# Altium schematic sheet Sheet1.SchDoc
size A4; SheetNumber: 1; SheetTotal: 1
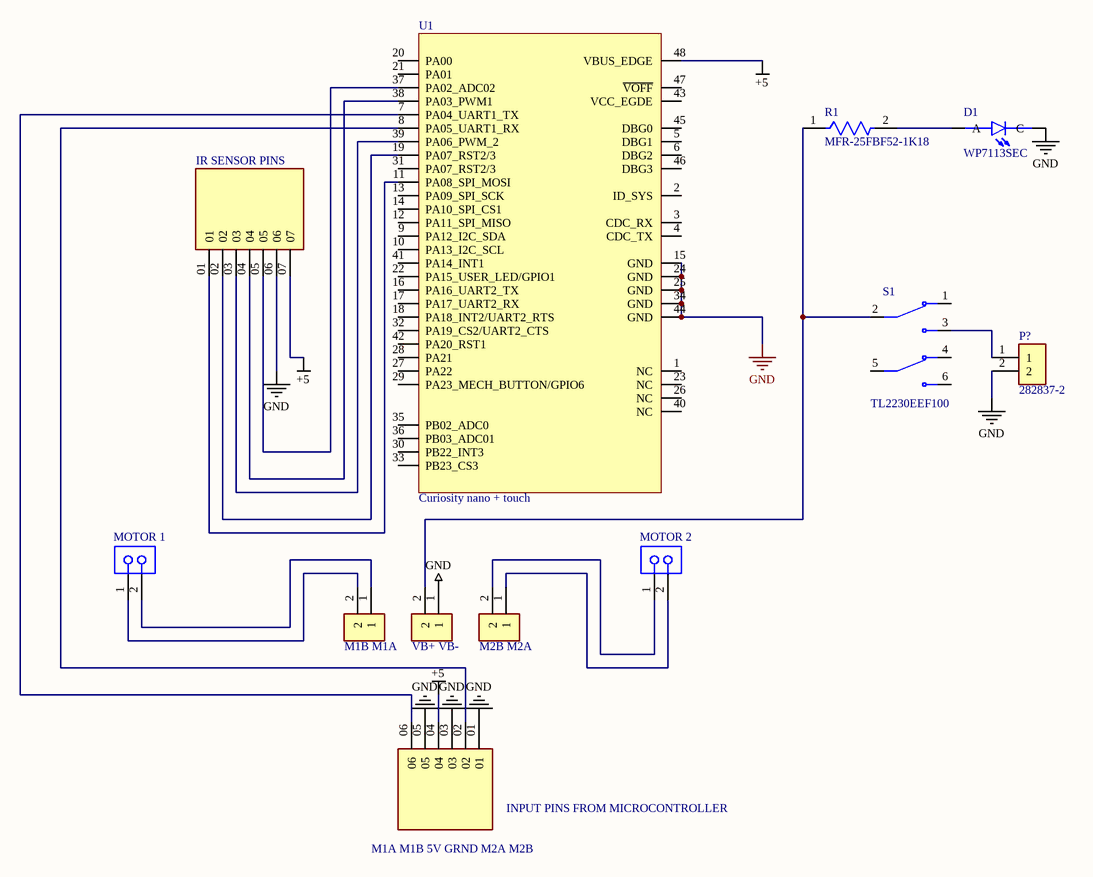
[diagram p0: Sheet1.SchDoc]

## Parts
D1  WP7113SEC  [LED_WP7113SEC]
INPUT_PINS_FROM_MICROCONTROLLER  M1A M1B 5V GRND M2A M2B  [SAMTEC_MTSW-106-07-L-S-170]
IR_SENSOR_PINS  IR5 IR4 IR3 IR2 IR1 GND VCC  [SAMTEC_MTSW-107-22-L-S-380]  (value not drawn)
M1B_M1A  282837-2  [TE_282837-2]  (value not drawn)
M2B_M2A  282837-2  [TE_282837-2]  (value not drawn)
MOTOR_1  SSW-102-02-F-S  [SMTC-SSW-102-02-X-S]  (value not drawn)
MOTOR_2  SSW-102-02-F-S  [SMTC-SSW-102-02-X-S]  (value not drawn)
P?  282837-2  [TE_282837-2]
R1  MFR-25FBF52-1K18  [FP-MFR-25-MFG]
S1  TL2230EEF100  [SW_TL2230EEF100]
U1  Curiosity nano + touch  [PCBComponent_1]
VB+_VB-  282837-2  [TE_282837-2]  (value not drawn)

## Nets
+5: INPUT_PINS_FROM_MICROCONTROLLER.04 IR_SENSOR_PINS.07 U1.48(VBUS_EDGE)
GND: D1.C INPUT_PINS_FROM_MICROCONTROLLER.01 INPUT_PINS_FROM_MICROCONTROLLER.03 INPUT_PINS_FROM_MICROCONTROLLER.05 IR_SENSOR_PINS.06 P?.2 U1.15(GND) U1.24(GND) U1.25(GND) U1.34(GND) U1.44(GND) VB+_VB-.1
NetD1_A: D1.A R1.2
NetINPUT_PINS_FROM_MICROCONTROLLER_02: INPUT_PINS_FROM_MICROCONTROLLER.02 U1.8(PA05_UART1_RX)
NetINPUT_PINS_FROM_MICROCONTROLLER_06: INPUT_PINS_FROM_MICROCONTROLLER.06 U1.7(PA04_UART1_TX)
NetIR_SENSOR_PINS_01: IR_SENSOR_PINS.01 U1.11(PA08_SPI_MOSI)
NetIR_SENSOR_PINS_02: IR_SENSOR_PINS.02 U1.19(PA07_RST2/3)
NetIR_SENSOR_PINS_03: IR_SENSOR_PINS.03 U1.39(PA06_PWM_2)
NetIR_SENSOR_PINS_04: IR_SENSOR_PINS.04 U1.38(PA03_PWM1)
NetIR_SENSOR_PINS_05: IR_SENSOR_PINS.05 U1.37(PA02_ADC02)
NetM1B_M1A_1: M1B_M1A.1 MOTOR_1.2
NetM1B_M1A_2: M1B_M1A.2 MOTOR_1.1
NetM2B_M2A_1: M2B_M2A.1 MOTOR_2.2
NetM2B_M2A_2: M2B_M2A.2 MOTOR_2.1
NetP?_1: P?.1 S1.3(NO1)
NetR1_1: R1.1 S1.2(COM1) VB+_VB-.2

Not connected (* = marked no-connect by the designer): S1 1(NC1) 4(NC2) 5(COM2) 6(NO2); U1 1(NC) 2(ID_SYS) 3(CDC_RX) 4(CDC_TX) 5(DBG1) 6(DBG2) 9(PA12_I2C_SDA) 10(PA13_I2C_SCL) 12(PA11_SPI_MISO) 13(PA09_SPI_SCK) 14(PA10_SPI_CS1) 16(PA16_UART2_TX) 17(PA17_UART2_RX) 18(PA18_INT2/UART2_RTS) 20(PA00) 21(PA01) 22(PA15_USER_LED/GPIO1) 23(NC) 26(NC) 27(PA22) 28(PA21) 29(PA23_MECH_BUTTON/GPIO6) 30(PB22_INT3) 31(PA07_RST2/3) 32(PA19_CS2/UART2_CTS) 33(PB23_CS3) 35(PB02_ADC0) 36(PB03_ADC01) 40(NC) 41(PA14_INT1) 42(PA20_RST1) 43(VCC_EGDE) 45(DBG0) 46(DBG3) 47(~{VOFF})

## Library data of the parts
D1 = WP7113SEC: LED Thru-Hole Orange T1-3/4 5mm Clear Lens 30mA 610nm 2500mcd Round | Kingbright WP7113SEC; SnapEDA_Link: https://www.snapeda.com/parts/WP7113SEC/Kingbright/view-part/?ref=snap; Package: Radial Kingbright; Value: *; MF: Kingbright; MP: WP7113SEC; Check_prices: https://www.snapeda.com/parts/WP7113SEC/Kingbright/view-part/?ref=eda
INPUT_PINS_FROM_MICROCONTROLLER = MTSW-106-07-L-S-170: Value: *; Availability: Unavailable; Package: None; Price: None; MP: MTSW-106-07-L-S-170
IR_SENSOR_PINS = MTSW-107-22-L-S-380: Value: *; MP: MTSW-107-22-L-S-380; Package: None; Price: None; Availability: Unavailable
M1B_M1A M2B_M2A P? VB+_VB- = 282837-2: Ð Ð°Ð·ÑŠÐµÐ¼Ð½Ñ‹Ðµ ÐºÐ»ÐµÐ¼Ð¼Ð½Ñ‹Ðµ ÐºÐ¾Ð»Ð¾Ð´ÐºÐ¸ Ð Ð¾Ð·ÐµÑ‚ÐºÐ° 2 Ð¿Ð¾Ð»Ð¾Ð¶ÐµÐ½Ð¸Ñ 5,08 Ð¼Ð¼ ÐŸÑ€Ð¸Ð¿Ð¾Ð¹ Ð¿Ñ€ÑÐ¼Ð¾Ð¹ Ñ‡ÐµÑ€ÐµÐ· Ð¾Ñ‚Ð²ÐµÑ€ÑÑ‚Ð¸Ðµ 13,5 Ð / ÐºÐ¾Ð½Ñ‚Ð°ÐºÑ‚; MF: TE Connectivity; SnapEDA_Link: https://www.snapeda.com/parts/282837-2/TE+Connectivity+AMP+Connectors/view-part/?ref=snap; Price: None; Check_prices: https://www.snapeda.com/parts/282837-2/TE+Connectivity+AMP+Connectors/view-part/?ref=eda; Purchase-URL: https://pricing.snapeda.com/search/part/282837-2/?ref=eda; MP: 282837-2; Value: *; Availability: In Stock; Package: None
MOTOR_1 MOTOR_2 = CMP-1023-00322-1: SQ Post Socket, Through-hole, Vertical, -55 to 125 degC, 2.54 mm Pitch, 2-Pin, Female, RoHS; Manufacturer: Samtec; Pitch: 2.54 mm; ComponentLink3URL: http://www.samtec.com/documents/webfiles/cpdf/SSW-1XX-XX-XXX-X-XX-XXX-XX-MKT.pdf; ComponentLink3Description: Package Specification; PartNumber: SSW-102-02-F-S; ComponentLink2Description: Datasheet; DatasheetVersion: F-214; Temperature Range: -55 to 125 degC; Orientation: Vertical; PackageReference: SSW-102-02-X-S; ComponentLink1URL: http://www.samtec.com; RoHS: True; ComponentLink1Description: Manufacturer URL; PackageDescription: Assembly, Socket Strip .016 X .031 Tail; Mounting Technology: Through-hole; PackageVersion: CA, 6/1987; ComponentLink2URL: http://www.samtec.com/documents/webfiles/pdf/SSW_TH.PDF
R1 = CMP-03413-000001-1: RES 1.18K OHM 1/4W 1% AXIAL; Manufacturer: Yageo; Value: 1.18kΩ; Temperature Coefficient: 100ppm/°C; Power Rating: 0.25W; Voltage Rating: 250V; Temperature: -55°C to +155°C; Automotive: No; Temperature Range High: +155°C; Mouser Description: Metal Film Resistors 1.18K OHM 1/4W 1%; Digikey Description: RES 1.18K OHM 1/4W 1% AXIAL; Lead Free: Yes; Tolerance: 1%; ComponentLink2Description: Datasheet; ComponentLink2URL: https://www.yageo.com/upload/media/product/products/datasheet/lr/Yageo_LR_MFR_1.pdf; Temperature Range Low: -55°C; Package: MFR-25; Ipc Land Pattern Name: RESAD1000W75L680D260; Composition: Metal Film; Category: Res; Octopart: https://octopart.com/mfr-25fbf52-1k18-yageo-56251681; Series: MFR; Device Class L2: Resistors; Height: 2.6mm; Resistance: 1.18kΩ; Device Class L3: Through-Hole Resistors; Manufacturer Part Number: MFR-25FBF52-1K18; RoHS: TRUE; Device Class L1: Passive Components
S1 = TL2230EEF100: PUSHBUTTON, 100mA, 30VDC DPDT, On-On Through Hole; MF: E-Switch; SnapEDA_Link: https://www.snapeda.com/parts/TL2230EEF100/E-Switch/view-part/?ref=snap; Package: None; Value: *; MP: TL2230EEF100; Check_prices: https://www.snapeda.com/parts/TL2230EEF100/E-Switch/view-part/?ref=eda